# Altium schematic sheet MCU.SchDoc: Relay Tester
size A4 portrait; Date: 2018.12.12; Author: Ivan Perehiniak; Address2: Ivan Perehiniak; Address3: iv.perehinik@gmail.com; Revision: 3; SheetNumber: 2; SheetTotal: 6
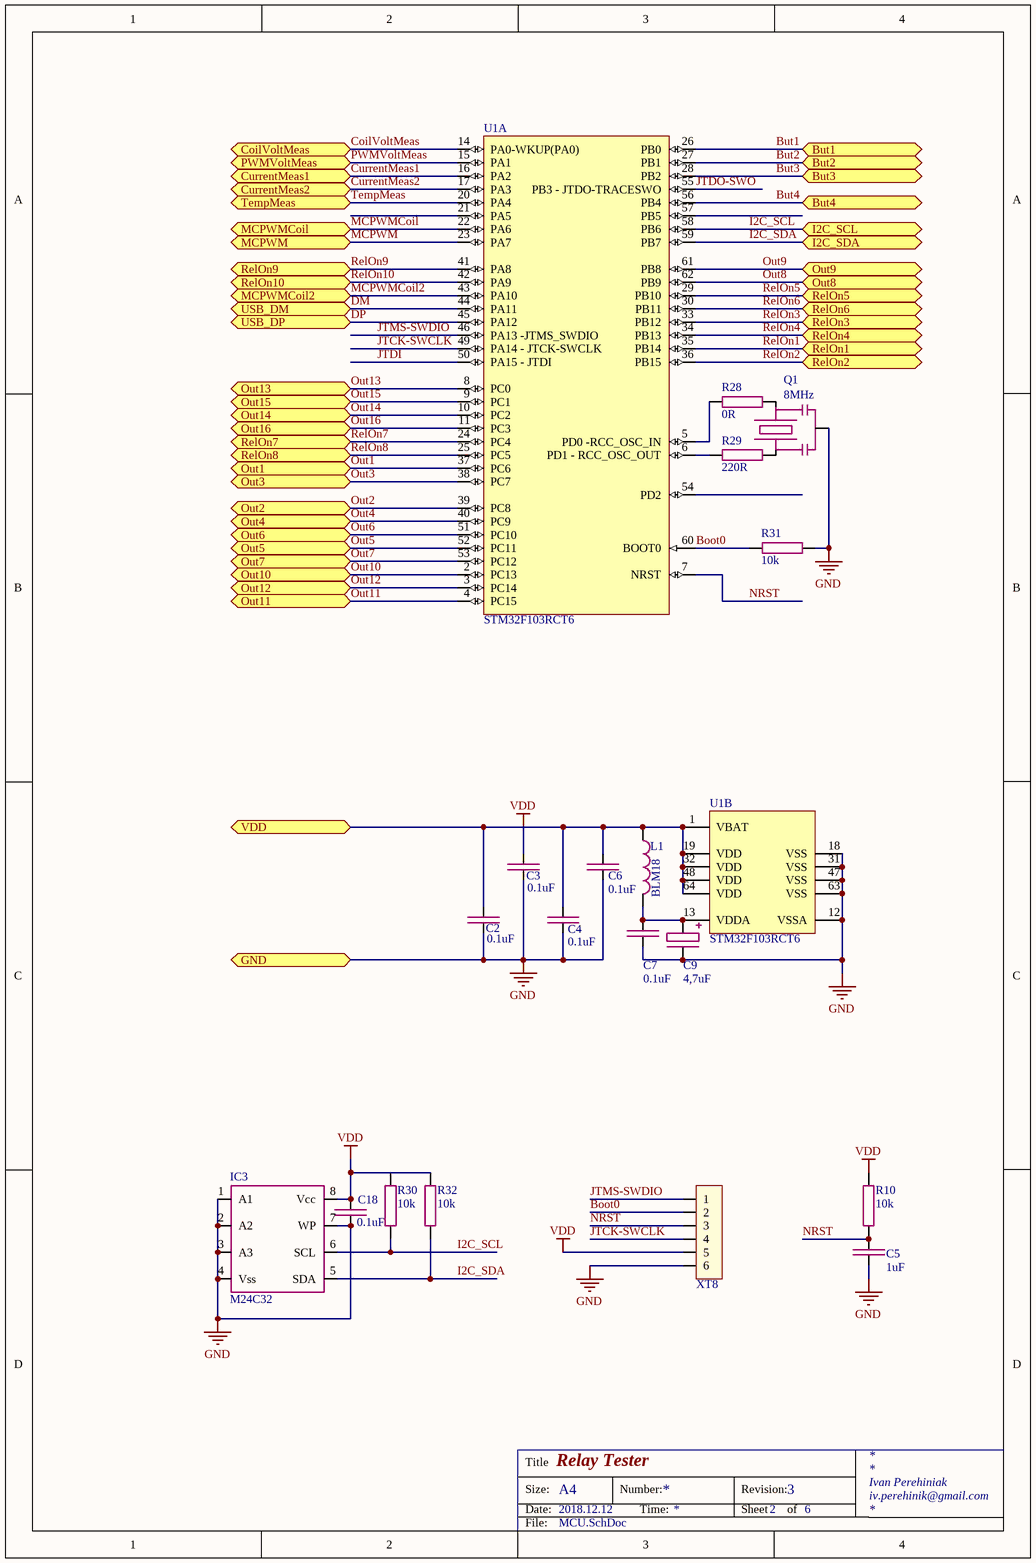
[diagram p0: MCU.SchDoc]

## Parts
C2  0.1uF  [C0603]
C3  0.1uF  [C0603]
C4  0.1uF  [C0603]
C5  1uF  [C0603]
C6  0.1uF  [C0603]
C7  0.1uF  [C0603]
C9  4,7uF  [1206(Tantal A)]
C18  0.1uF  [C0603]
IC3  M24C32  [SOIC_N]
L1  BLM18  [L0603]
Q1  8MHz  [CSTCE_V]
R10  10k  [R0603]
R28  0R  [R0603]
R29  220R  [R0603]
R30  10k  [R0603]
R31  10k  [R0603]
R32  10k  [R0603]
U1  STM32F103RCT6  [STM-LQFP64_V]  (parts A,B of 2)
XT8  PLS-6  [PLS-6]  (value not drawn)

## Ports
But1, But2, But3, But4, CoilVoltMeas, CurrentMeas1, CurrentMeas2, GND, I2C_SCL, I2C_SDA, MCPWM, MCPWMCoil, MCPWMCoil2, Out1, Out2, Out3, Out4, Out5, Out6, Out7, Out8, Out9, Out10, Out11, Out12, Out13, Out14, Out15, Out16, PWMVoltMeas, RelOn1, RelOn2, RelOn3, RelOn4, RelOn5, RelOn6, RelOn7, RelOn8, RelOn9, RelOn10, TempMeas, USB_DM, USB_DP, VDD

## Nets
GND: C2.1 C3.1 C4.1 C5.2 C6.1 C7.1 C9.2(-) C18.1 IC3.1(A1) IC3.2(A2) IC3.3(A3) IC3.4(Vss) IC3.7(WP) Q1.2 R31.2 U1.12(VSSA) U1.18(VSS) U1.31(VSS) U1.47(VSS) U1.63(VSS) XT8.6 ; port GND
VDD: C2.2 C3.2 C4.2 C6.2 C18.2 IC3.8(Vcc) L1.1 R10.2 R30.2 R32.2 U1.1(VBAT) U1.19(VDD) U1.32(VDD) U1.48(VDD) U1.64(VDD) XT8.5 ; port VDD
Boot0: R31.1 U1.60(BOOT0) XT8.2
But1: U1.26(PB0) ; port But1
But2: U1.27(PB1) ; port But2
But3: U1.28(PB2) ; port But3
But4: U1.56(PB4) ; port But4
CoilVoltMeas: U1.14(PA0-WKUP(PA0)) ; port CoilVoltMeas
CurrentMeas1: U1.16(PA2) ; port CurrentMeas1
CurrentMeas2: U1.17(PA3) ; port CurrentMeas2
DM: U1.44(PA11) ; port USB_DM
DP: U1.45(PA12) ; port USB_DP
I2C_SCL: IC3.6(SCL) R30.1 U1.58(PB6) ; port I2C_SCL
I2C_SDA: IC3.5(SDA) R32.1 U1.59(PB7) ; port I2C_SDA
JTCK-SWCLK: U1.49(PA14_-_JTCK-SWCLK) XT8.4
JTDI: U1.50(PA15_-_JTDI)
JTDO-SWO: U1.55(PB3_-_JTDO-TRACESWO)
JTMS-SWDIO: U1.46(PA13_-JTMS_SWDIO) XT8.1
MCPWM: U1.23(PA7) ; port MCPWM
MCPWMCoil: U1.22(PA6) ; port MCPWMCoil
MCPWMCoil2: U1.43(PA10) ; port MCPWMCoil2
NRST: C5.1 R10.1 U1.7(NRST) XT8.3
Out1: U1.37(PC6) ; port Out1
Out2: U1.39(PC8) ; port Out2
Out3: U1.38(PC7) ; port Out3
Out4: U1.40(PC9) ; port Out4
Out5: U1.52(PC11) ; port Out5
Out6: U1.51(PC10) ; port Out6
Out7: U1.53(PC12) ; port Out7
Out8: U1.62(PB9) ; port Out8
Out9: U1.61(PB8) ; port Out9
Out10: U1.2(PC13) ; port Out10
Out11: U1.4(PC15) ; port Out11
Out12: U1.3(PC14) ; port Out12
Out13: U1.8(PC0) ; port Out13
Out14: U1.10(PC2) ; port Out14
Out15: U1.9(PC1) ; port Out15
Out16: U1.11(PC3) ; port Out16
PWMVoltMeas: U1.15(PA1) ; port PWMVoltMeas
RelOn1: U1.35(PB14) ; port RelOn1
RelOn2: U1.36(PB15) ; port RelOn2
RelOn3: U1.33(PB12) ; port RelOn3
RelOn4: U1.34(PB13) ; port RelOn4
RelOn5: U1.29(PB10) ; port RelOn5
RelOn6: U1.30(PB11) ; port RelOn6
RelOn7: U1.24(PC4) ; port RelOn7
RelOn8: U1.25(PC5) ; port RelOn8
RelOn9: U1.41(PA8) ; port RelOn9
RelOn10: U1.42(PA9) ; port RelOn10
TempMeas: U1.20(PA4) ; port TempMeas
NetC7_2: C7.2 C9.1(+) L1.2 U1.13(VDDA)
NetQ1_1: Q1.1 R29.2
NetQ1_3: Q1.3 R28.2
NetR28_1: R28.1 U1.5(PD0_-RCC_OSC_IN)
NetR29_1: R29.1 U1.6(PD1_-_RCC_OSC_OUT)

Not connected (* = marked no-connect by the designer): U1 21(PA5) 54(PD2) 57(PB5)

## Notes on the sheet
- Title
- Size:
- Date:
- A4
- Number:
- Time:
- Revision:
- Sheet
- of
- File:

## Library data of the parts
C2-C4 C6 C7 C18 = GMK316F475ZG-T: CAP CER 0.1UF 50V X7R 0603; Category: Capacitors; Manufacturer Part Number: GMK316F475ZG-T; Package / Case: 0603 (1608 Metric); ComponentLink1URL: https://search.kemet.com/component-edge/download/datasheet/C0603C104K5RACTU.pdf; ComponentLink1Description: https://search.kemet.com/component-edge/download/datasheet/C0603C104K5RACTU.pdf
C5 = GRM188R71E105KA12D: CAP CER 1UF 25V X7R 0603; Category: Capacitors; Manufacturer Part Number: GRM188R71E105KA12D; Package / Case: 0603 (1608 Metric)
C9 = T491A475K010AT: CAP TANT 4.7UF 10V 10% 1206; Category: Capacitors; Manufacturer Part Number: T491A475K010AT; Package / Case: 1206 (3216 Metric)
IC3 = M24C32-WMN6TP: IC EEPROM 32KBIT 400KHZ 8SO; Category: Integrated Circuits (ICs); Package / Case: 8-SOIC (0.154", 3.90mm Width); Manufacturer Part Number: M24C32-WMN6TP
L1 = BLM18TG601TN1D: FERRITE BEAD 600 OHM 0603 1LN; Category: Filters; Manufacturer Part Number: BLM18TG601TN1D; Package / Case: 0603 (1608 Metric)
Q1 = CSTCE8M00G55Z-R0: CER RES 8.0000MHZ 33PF SMD; Manufacturer Part Number: CSTCE8M00G55Z-R0; Package / Case: 3-SMD, Non-Standard; Category: Crystals, Oscillators, Resonators; ComponentLink1URL: http://www.murata.com/~/media/webrenewal/support/library/catalog/products/timingdevice/ceralock/p16e.ashx; ComponentLink1Description: http://www.murata.com/~/media/webrenewal/support/library/catalog/products/timingdevice/ceralock/p16e.ashx
R10 R30-R32 = ERJ-S03J103V: RES SMD 10K OHM 5% 1/10W 0603; Category: Resistors; Package / Case: 0603 (1608 Metric); Manufacturer Part Number: ERJ-S03J103V; ComponentLink1URL: https://industrial.panasonic.com/cdbs/www-data/pdf/RDA0000/AOA0000C304.pdf; ComponentLink1Description: https://industrial.panasonic.com/cdbs/www-data/pdf/RDA0000/AOA0000C304.pdf; ComponentLink2URL: http://industrial.panasonic.com/www-cgi/jvcr13pz.cgi?E+PZ+3+AOA0005+ERJS03J101V+7+WW; ComponentLink2Description: http://industrial.panasonic.com/www-cgi/jvcr13pz.cgi?E+PZ+3+AOA0005+ERJS03J101V+7+WW; ComponentLink3URL: https://industrial.panasonic.com/cdbs/www-data/pdf/RDO0000/AOA0000C331.pdf; ComponentLink3Description: https://industrial.panasonic.com/cdbs/www-data/pdf/RDO0000/AOA0000C331.pdf
R28 = CRCW06030000Z0EA: RES SMD 0 OHM JUMPER 1/10W 0603; Category: Resistors; Package / Case: 0603 (1608 Metric); Manufacturer Part Number: CRCW06030000Z0EA
R29 = ERJ-3GEYJ221V: RES SMD 220 OHM 5% 1/10W 0603; Category: Resistors; Package / Case: 0603 (1608 Metric); Manufacturer Part Number: ERJ-3GEYJ221V; ComponentLink1URL: https://industrial.panasonic.com/cdbs/www-data/pdf/RDA0000/AOA0000C304.pdf; ComponentLink1Description: https://industrial.panasonic.com/cdbs/www-data/pdf/RDA0000/AOA0000C304.pdf; ComponentLink2URL: http://industrial.panasonic.com/www-cgi/jvcr13pz.cgi?E+PZ+3+AOA0005+ERJS03J101V+7+WW; ComponentLink2Description: http://industrial.panasonic.com/www-cgi/jvcr13pz.cgi?E+PZ+3+AOA0005+ERJS03J101V+7+WW; ComponentLink3URL: https://industrial.panasonic.com/cdbs/www-data/pdf/RDO0000/AOA0000C331.pdf; ComponentLink3Description: https://industrial.panasonic.com/cdbs/www-data/pdf/RDO0000/AOA0000C331.pdf
U1 = STM32F103RCT6: IC MCU 32BIT 256KB FLASH 64LQFP; Category: Integrated Circuits (ICs); Manufacturer Part Number: STM32F103RCT6; Package / Case: 64-LQFP
XT8 = PLS-6: CONN HEADER 6POS .100 STR TIN; Manufacturer Part Number: 68000-407HLF; Category: Connectors, Interconnects